# EAGLE design Shift_Rotate (EAGLE 7.6.0)
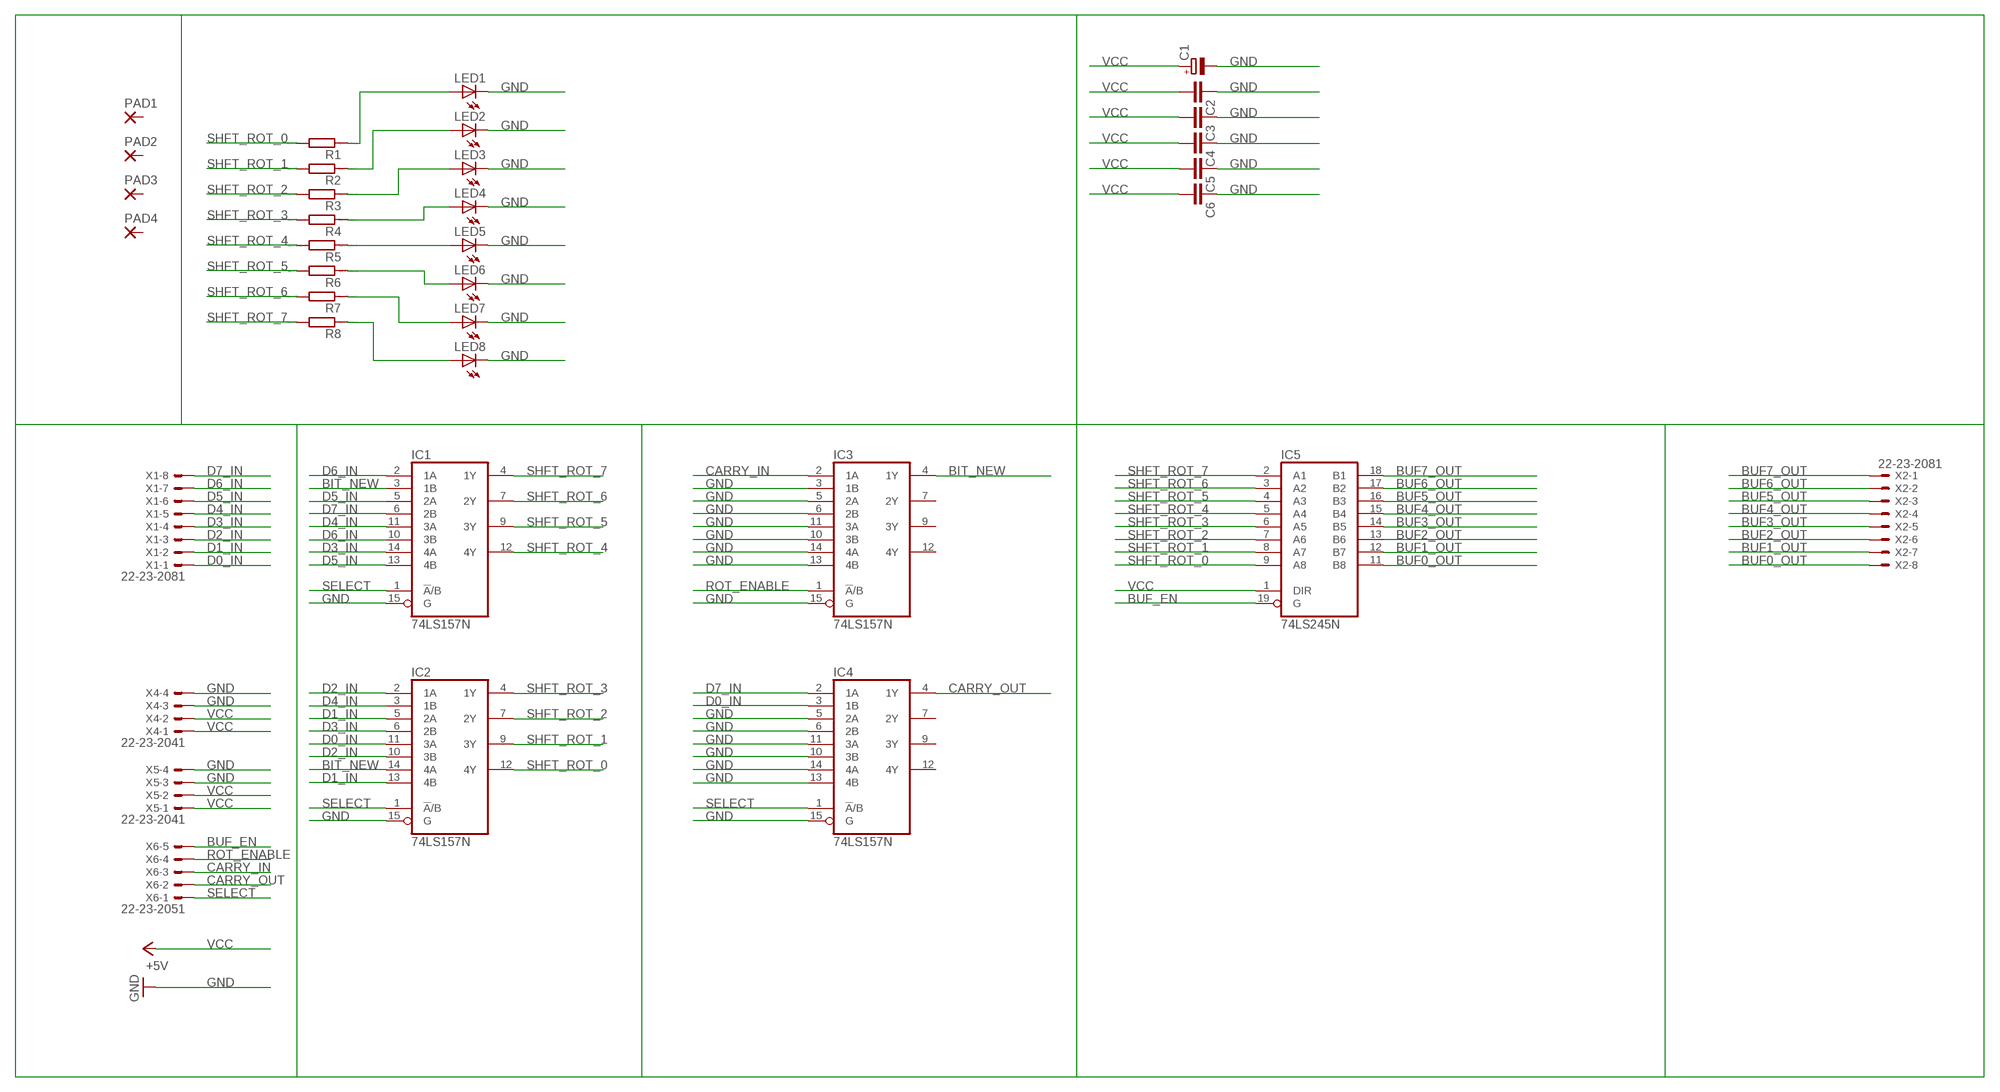
[diagram p0: schematic, sheet 1]

## Parts
C1  CPOL-EUE2.5-6  [E2,5-6]
C2  C-EU025-025X050  [C025-025X050]
C3  C-EU025-025X050  [C025-025X050]
C4  C-EU025-025X050  [C025-025X050]
C5  C-EU025-025X050  [C025-025X050]
C6  C-EU025-025X050  [C025-025X050]
IC1  74LS157N  [DIL16]
IC2  74LS157N  [DIL16]
IC3  74LS157N  [DIL16]
IC4  74LS157N  [DIL16]
IC5  74LS245N  [DIL20]
LED1  LED5MM  [LED5MM]
LED2  LED5MM  [LED5MM]
LED3  LED5MM  [LED5MM]
LED4  LED5MM  [LED5MM]
LED5  LED5MM  [LED5MM]
LED6  LED5MM  [LED5MM]
LED7  LED5MM  [LED5MM]
LED8  LED5MM  [LED5MM]
PAD1  3,17/1,3  [3,17/1,3]
PAD2  3,17/1,3  [3,17/1,3]
PAD3  3,17/1,3  [3,17/1,3]
PAD4  3,17/1,3  [3,17/1,3]
R1  R0207/10  [0207/10]
R2  R0207/10  [0207/10]
R3  R0207/10  [0207/10]
R4  R0207/10  [0207/10]
R5  R0207/10  [0207/10]
R6  R0207/10  [0207/10]
R7  R0207/10  [0207/10]
R8  R0207/10  [0207/10]
X1  22-23-2081  [22-23-2081]
X2  22-23-2081  [22-23-2081]
X4  22-23-2041  [22-23-2041]
X5  22-23-2041  [22-23-2041]
X6  22-23-2051  [22-23-2051]

## Nets
BIT_NEW [suply]: IC1.3(1B) IC2.14(4A) IC3.4(1Y)
BUF0_OUT: IC5.11(B8) X2.8
BUF1_OUT: IC5.12(B7) X2.7
BUF2_OUT: IC5.13(B6) X2.6
BUF3_OUT: IC5.14(B5) X2.5
BUF4_OUT: IC5.15(B4) X2.4
BUF5_OUT: IC5.16(B3) X2.3
BUF6_OUT: IC5.17(B2) X2.2
BUF7_OUT: IC5.18(B1) X2.1
BUF_EN: IC5.19(G) X6.5
CARRY_IN: IC3.2(1A) X6.3
CARRY_OUT: IC4.4(1Y) X6.2
D0_IN: IC2.11(3A) IC4.3(1B) X1.1
D1_IN: IC2.5(2A) IC2.13(4B) X1.2
D2_IN: IC2.2(1A) IC2.10(3B) X1.3
D3_IN: IC1.14(4A) IC2.6(2B) X1.4
D4_IN: IC1.11(3A) IC2.3(1B) X1.5
D5_IN: IC1.5(2A) IC1.13(4B) X1.6
D6_IN: IC1.2(1A) IC1.10(3B) X1.7
D7_IN: IC1.6(2B) IC4.2(1A) X1.8
GND [suply]: C1.- C2.1 C3.1 C4.1 C5.1 C6.1 IC1.15(G) IC2.15(G) IC3.3(1B) IC3.5(2A) IC3.6(2B) IC3.10(3B) IC3.11(3A) IC3.13(4B) IC3.14(4A) IC3.15(G) IC4.5(2A) IC4.6(2B) IC4.10(3B) IC4.11(3A) IC4.13(4B) IC4.14(4A) IC4.15(G) LED1.K(C) LED2.K(C) LED3.K(C) LED4.K(C) LED5.K(C) LED6.K(C) LED7.K(C) LED8.K(C) X4.3 X4.4 X5.3 X5.4
N$9: LED1.A R1.1
N$10: LED2.A R2.1
N$11: LED3.A R3.1
N$12: LED4.A R4.1
N$13: LED5.A R5.1
N$14: LED6.A R6.1
N$15: LED7.A R7.1
N$16: LED8.A R8.1
ROT_ENABLE: IC3.1(!A!/B) X6.4
SELECT: IC1.1(!A!/B) IC2.1(!A!/B) IC4.1(!A!/B) X6.1
SHFT_ROT_0: IC2.12(4Y) IC5.9(A8) R1.2
SHFT_ROT_1: IC2.9(3Y) IC5.8(A7) R2.2
SHFT_ROT_2: IC2.7(2Y) IC5.7(A6) R3.2
SHFT_ROT_3: IC2.4(1Y) IC5.6(A5) R4.2
SHFT_ROT_4: IC1.12(4Y) IC5.5(A4) R5.2
SHFT_ROT_5: IC1.9(3Y) IC5.4(A3) R6.2
SHFT_ROT_6: IC1.7(2Y) IC5.3(A2) R7.2
SHFT_ROT_7: IC1.4(1Y) IC5.2(A1) R8.2
VCC [suply]: C1.+ C2.2 C3.2 C4.2 C5.2 C6.2 IC5.1(DIR) X4.1 X4.2 X5.1 X5.2 ; supply symbol labelled +5V
Unconnected: IC3.7(2Y) IC3.9(3Y) IC3.12(4Y) IC4.7(2Y) IC4.9(3Y) IC4.12(4Y) PAD1.1(P) PAD2.1(P) PAD3.1(P) PAD4.1(P)

## Power pins joined to a net without a drawn wire
GND: IC1.8(GND) IC2.8(GND) IC3.8(GND) IC4.8(GND) IC5.10(GND)
VCC: IC1.16(VCC) IC2.16(VCC) IC3.16(VCC) IC4.16(VCC) IC5.20(VCC)

## Library data of the parts
C1 = resistor:CPOL-EU: POLARIZED CAPACITOR, European symbol
C2-C6 = resistor:C-EU: CAPACITOR, European symbol
IC1-IC4 = 74xx-us:74*157: Quadruple 2-line to 1-line data SELECTOR/MULTIPLEXER
IC5 = 74xx-us:74*245: Octal BUS TRANSCEIVER, 3-state
LED1-LED8 = led:LED: LED OSRAM: - CHIPLED LG R971, LG N971, LY N971, LG Q971, LY Q971, LO R971, LY R971 LH N974, LH R974 LS Q976, LO Q976, LY Q976 LO Q996 - Hyper CHIPLED LW Q18S LB Q993, LB Q99A, LB R99A - SideLED LS A670, LO A670, LY A670, LG A670, LP A670 LB A673, LV A673, LT A673, LW A673 LH A674 LY A675 LS A676, LA A676, LO A676, LY A676, LW A676 LS A679, LY A679, LG A679 - Hyper Micro SIDELED® LS Y876, LA Y876, LO Y876, LY Y876 LT Y87S - SmartLED LW L88C, LW L88S LB L89C, LB L89S, LG L890 LS L89K, LO L89K, LY L89K LS L896, LA L896, LO L896, LY L896 - TOPLED LS T670, LO T670, LY T670, LG T670, LP T670 LSG T670, LSP T670, LSY T670, LOP T670, LYG T670 LG T671, LOG T671, LSG T671 LB T673, LV T673, LT T673, LW T673 LH T674 LS T676, LA T676, LO T676, LY T676, LB T676, LH T676, LSB T676, LW T676 LB T67C, LV T67C, LT T67C, LS T67K, LO T67K, LY T67K, LW E67C LS E67B, LA E67B, LO E67B, LY E67B, LB E67C, LV E67C, LT E67C LW T67C LS T679, LY T679, LG T679 LS T770, LO T770, LY T770, LG T770, LP T770 LB T773, LV T773, LT T773, LW T773 LH T774 LS E675, LA E675, LY E675, LS T675 LS T776, LA T776, LO T776, LY T776, LB T776 LHGB T686 LT T68C, LB T68C - Hyper Mini TOPLED® LB M676 - Mini TOPLED Santana® LG M470 LS M47K, LO M47K, LY M47K Source: http://www.osram.convergy.de LUXEON: - LUMILED® LXK2-PW12-R00, LXK2-PW12-S00, LXK2-PW14-U00, LXK2-PW14-V00 LXK2-PM12-R00, LXK2-PM12-S00, LXK2-PM14-U00 LXK2-PE12-Q00, LXK2-PE12-R00, LXK2-PE12-S00, LXK2-PE14-T00, LXK2-PE14-U00 LXK2-PB12-K00, LXK2-PB12-L00, LXK2-PB12-M00, LXK2-PB14-N00, LXK2-PB14-P00, LXK2-PB14-Q00 LXK2-PR12-L00, LXK2-PR12-M00, LXK2-PR14-Q00, LXK2-PR14-R00 LXK2-PD12-Q00, LXK2-PD12-R00, LXK2-PD12-S00 LXK2-PH12-R00, LXK2-PH12-S00 LXK2-PL12-P00, LXK2-PL12-Q00, LXK2-PL12-R00 Source: www.luxeon.com KINGBRIGHT: KA-3528ASYC Source: www.kingbright.com
PAD1-PAD4 = wirepad:3,17/1,3: THROUGH-HOLE PAD
R1-R8 = eagle-ltspice:R: RESISTOR, European symbol; SPICEMODEL: NONE; SPICEPREFIX: R
X1 X2 = con-molex:22-23-2081: .100" (2.54mm) Center Header - 8 Pin; MF: MOLEX; MPN: 22-23-2081; OC_FARNELL: 1756826; OC_NEWARK: 01C7592
X4 X5 = con-molex:22-23-2041: .100" (2.54mm) Center Header - 4 Pin; MF: MOLEX; MPN: 22-23-2041; OC_FARNELL: 1462920; OC_NEWARK: 38C0355
X6 = con-molex:22-23-2051: .100" (2.54mm) Center Header - 5 Pin; MF: MOLEX; MPN: 22-23-2051; OC_FARNELL: 1462952; OC_NEWARK: 38C9178

## Net classes
1 suply: width 1.016 mm

## Board
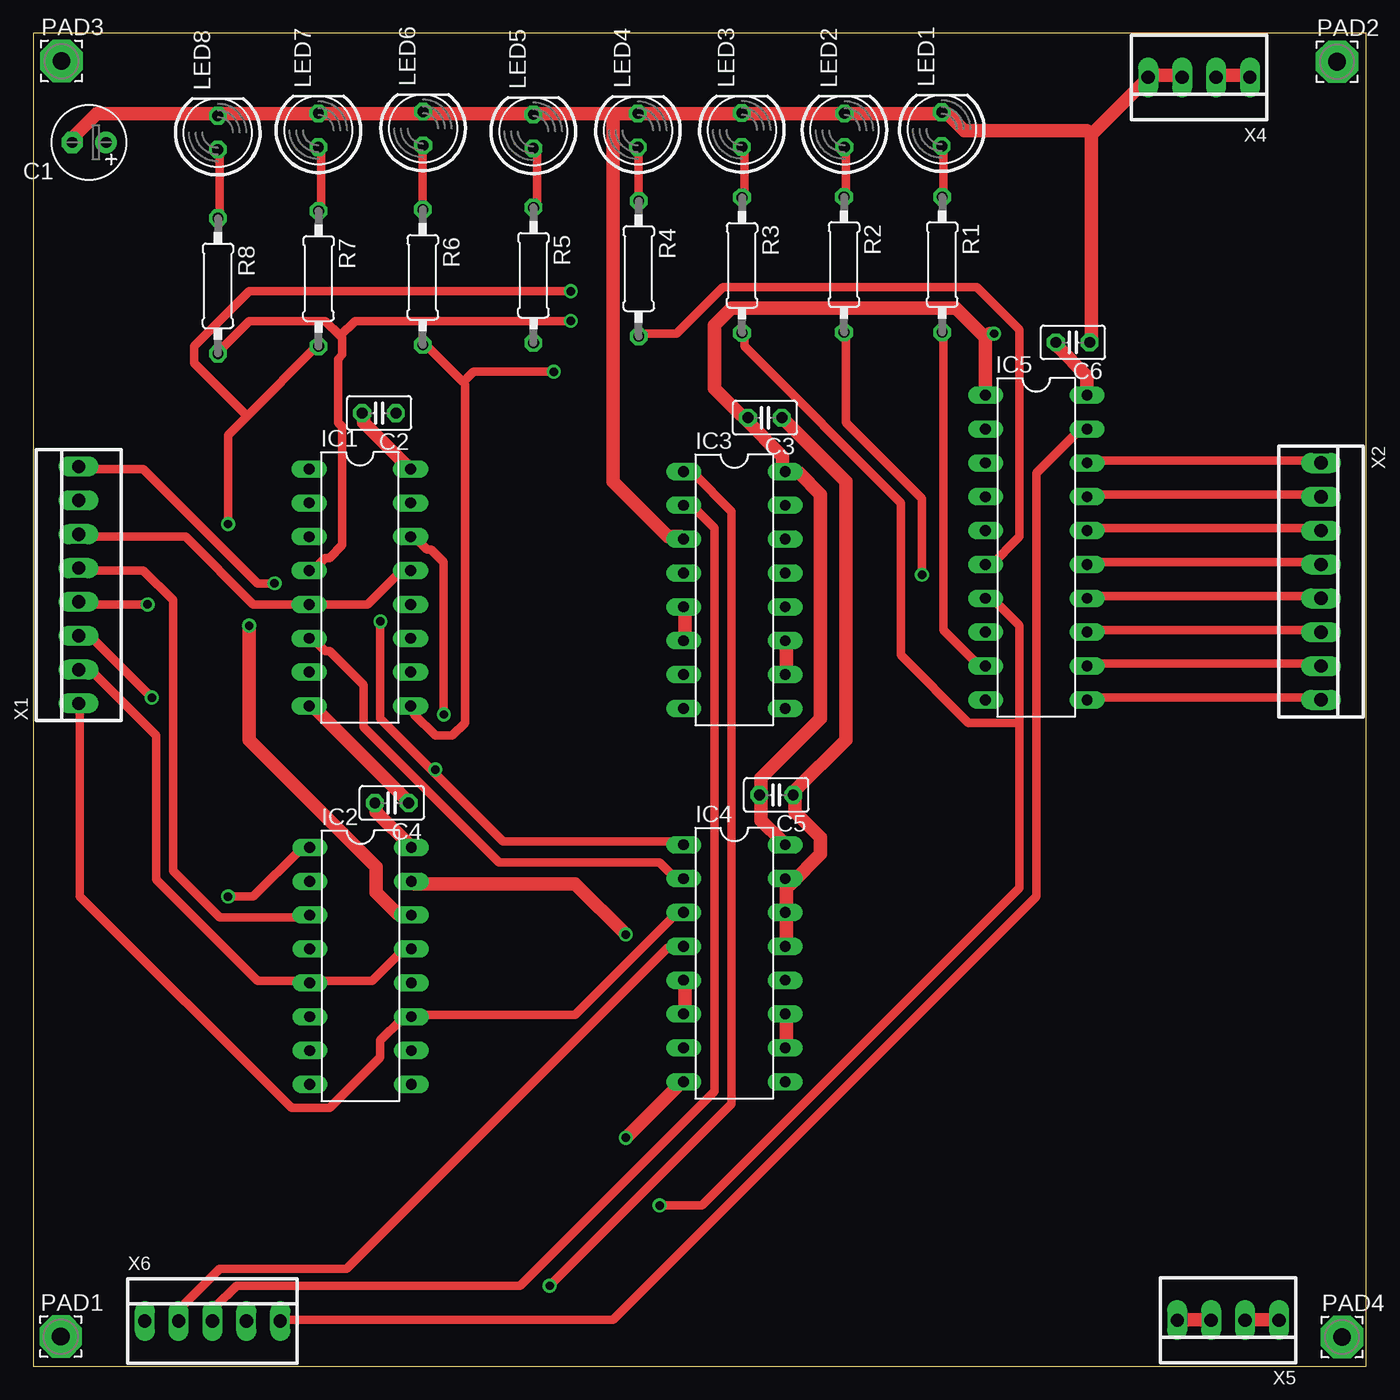
[diagram p1: board, top side]
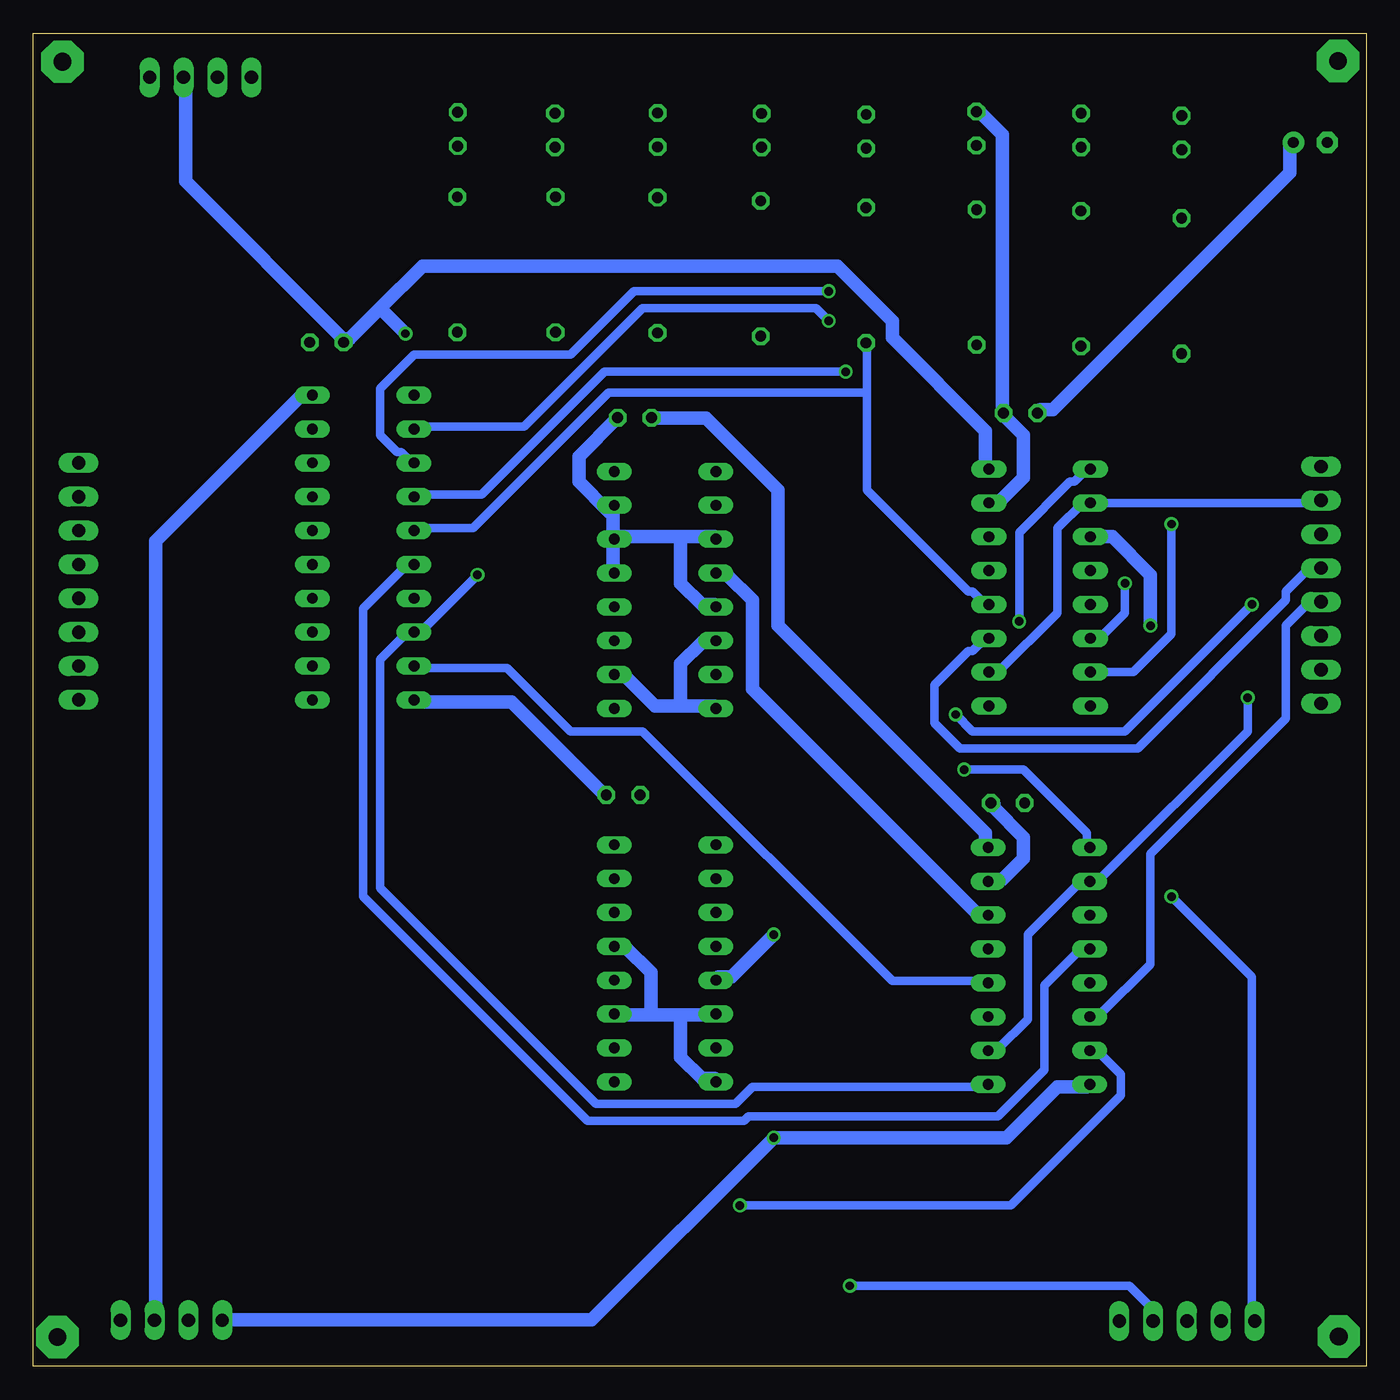
[diagram p2: board, bottom side, seen from below]

Size 100 x 100 mm. Coordinates in mm from the lower left corner, seen from the top.
Outline: 0,0 100,0 100,100 0,100 0,0
Copper layers (1*16): Top 0.035mm / dielectric 1.5mm / Bottom 0.035mm
Design rules "default *": minimum track width 25mil, minimum drill 25mil, track to track 25mil, track to pad 25mil, pad to pad 25mil, via to via 25mil, smd to smd 8mil, copper to edge 40mil, drill to drill 8mil, minimum pad ring 10mil, minimum via ring 8mil, stop-mask expansion 4mil, vias tented up to drill 0mil, thermal gap 10mil

### Footprints (pad centres in the part's own frame; a part is rotated, then mirrored left to right if it is on the bottom)
E2,5-6 = drill 0.813 pad 1.6: + -1.27,0 | drill 0.813 pad 1.6 octagon: - 1.27,0
C025-025X050 = drill 0.813 octagon: 1 -1.27,0; 2 1.27,0
DIL16 = drill 0.813 long: 1 -8.89,-3.81; 2 -6.35,-3.81; 3 -3.81,-3.81; 4 -1.27,-3.81; 5 1.27,-3.81; 6 3.81,-3.81; 7 6.35,-3.81; 8 8.89,-3.81; 9 8.89,3.81; 10 6.35,3.81; 11 3.81,3.81; 12 1.27,3.81; 13 -1.27,3.81; 14 -3.81,3.81; 15 -6.35,3.81; 16 -8.89,3.81
DIL20 = drill 0.813 long: 1 -11.43,-3.81; 2 -8.89,-3.81; 3 -6.35,-3.81; 4 -3.81,-3.81; 5 -1.27,-3.81; 6 1.27,-3.81; 7 3.81,-3.81; 8 6.35,-3.81; 9 8.89,-3.81; 10 11.43,-3.81; 11 11.43,3.81; 12 8.89,3.81; 13 6.35,3.81; 14 3.81,3.81; 15 1.27,3.81; 16 -1.27,3.81; 17 -3.81,3.81; 18 -6.35,3.81; 19 -8.89,3.81; 20 -11.43,3.81
LED5MM = drill 0.813 octagon: A -1.27,0; K 1.27,0
3,17/1,3 = drill 1.321 pad 3.175 octagon: 1 0,0
0207/10 = drill 0.813 octagon: 1 -5.08,0; 2 5.08,0
22-23-2081 = drill 1 long: 1 -8.89,0; 2 -6.35,0; 3 -3.81,0; 4 -1.27,0; 5 1.27,0; 6 3.81,0; 7 6.35,0; 8 8.89,0
22-23-2041 = drill 1 long: 1 -3.81,0; 2 -1.27,0; 3 1.27,0; 4 3.81,0
22-23-2051 = drill 1 long: 1 -5.08,0; 2 -2.54,0; 3 0,0; 4 2.54,0; 5 5.08,0

### Placement (x,y rotation side)
C1  4.19,91.81 180 top
C2  25.94,71.51 180 top
C3  54.89,71.16 180 top
C4  26.89,42.26 180 top
C5  55.74,42.86 180 top
C6  77.99,76.81 180 top
IC1  24.5,58.42 270 top
IC2  24.55,30.03 270 top
IC3  52.6,58.24 270 top
IC4  52.6,30.23 270 top
IC5  75.25,61.42 270 top
LED1  68.16,92.81 90 top
LED2  60.86,92.73 90 top
LED3  53.16,92.75 90 top
LED4  45.36,92.72 90 top
LED5  37.51,92.64 90 top
LED6  29.24,92.86 90 top
LED7  21.39,92.73 90 top
LED8  13.84,92.55 90 top
PAD1  2.06,2.22 0 top
PAD2  97.81,97.87 0 top
PAD3  2.11,97.92 0 top
PAD4  98.19,2.19 0 top
R1  68.19,82.65 270 top
R2  60.82,82.65 270 top
R3  53.17,82.6 270 top
R4  45.42,82.35 270 top
R5  37.52,81.85 270 top
R6  29.22,81.7 270 top
R7  21.4,81.6 270 top
R8  13.85,81.05 270 top
X1  3.4,58.61 90 top
X2  96.6,58.88 270 top
X4  87.46,96.7 180 top
X5  89.64,3.45 180 top
X6  13.44,3.4 0 top

### Tracks (layer width: path | path; a pad name or v marks a point on that pad's centre or on a via)
BIT_NEW  (via drill 0.64)
  Top 1.016: v16.19,55.56 16.19,46.99 25.72,37.47 25.72,35.56 27.3,33.97 28.26,33.97 IC2.14
  Bottom 1.016: IC2.14 28.57,33.97 29.21,33.97 46.04,50.8 46.04,57.47 47.94,59.37 48.58,59.37 IC3.4 | IC1.3 19.05,62.23 16.19,59.37 v16.19,55.56
BUF0_OUT
  Top 0.635: IC5.11 79.38,50.16 96.52,50.16 X2.8
BUF1_OUT
  Top 0.635: IC5.12 79.38,52.7 96.52,52.7 X2.7
BUF2_OUT
  Top 0.635: IC5.13 79.38,55.24 96.52,55.24 X2.6
BUF3_OUT
  Top 0.635: IC5.14 79.38,57.78 96.52,57.78 X2.5
BUF4_OUT
  Top 0.635: IC5.15 79.38,60.33 96.52,60.33 X2.4
BUF5_OUT
  Top 0.635: IC5.16 79.38,62.87 96.52,62.87 X2.3
BUF6_OUT
  Top 0.635: IC5.17 79.38,65.41 96.52,65.41 X2.2
BUF7_OUT
  Top 0.635: IC5.18 79.38,67.94 96.52,67.94 X2.1
BUF_EN
  Top 0.635: IC5.19 79.06,70.17 78.42,70.17 75.25,66.99 75.25,35.24 43.5,3.49 18.73,3.49 X6.5
CARRY_IN
  Top 0.635: IC3.2 48.9,64.45 49.53,64.45 51.12,62.87 51.12,20.64 36.51,6.03 15.24,6.03 13.65,4.45 13.65,3.49 X6.3
CARRY_OUT
  Top 0.635: IC4.4 48.58,31.43 47.62,31.43 23.5,7.3 13.97,7.3 11.11,4.45 11.11,3.49 X6.2
D0_IN
  Top 0.635: IC4.3 48.58,34.29 40.64,26.35 28.57,26.35 IC2.11 28.26,26.04 27.62,26.04 26.04,24.45 26.04,23.18 22.23,19.37 19.37,19.37 3.49,35.24 3.49,49.53 X1.1
D1_IN
  Top 0.635: IC2.13 28.26,31.11 27.62,31.11 25.4,28.89 20.95,28.89 IC2.5 20.64,28.89 16.83,28.89 9.21,36.51 9.21,47.31 4.45,52.07 3.49,52.07 X1.2
D2_IN  (via drill 0.64)
  Top 0.635: v8.89,50.16 4.45,54.61 3.49,54.61 X1.3
  Bottom 0.635: IC2.10 28.26,23.81 27.62,23.81 25.4,26.04 25.4,32.38 21.59,36.2 20.95,36.2 IC2.2 20.64,36.51 20,36.51 8.89,47.62 v8.89,50.16
D3_IN  (via drill 0.64)
  Top 0.635: v30.8,48.9 30.8,60.33 29.84,61.28 29.53,61.28 28.57,62.23 IC1.14 | v8.57,57.15 3.49,57.15 X1.4
  Bottom 0.635: IC2.6 20.64,26.35 20,26.35 16.19,30.16 16.19,38.42 6.03,48.58 6.03,55.56 4.45,57.15 3.49,57.15 X1.4 | v30.8,48.9 29.53,47.62 18.1,47.62 v8.57,57.15
D4_IN
  Top 0.635: IC2.3 20.64,33.66 13.97,33.66 10.48,37.15 10.48,57.47 8.26,59.69 3.49,59.69 X1.5
  Bottom 0.635: IC1.11 28.57,54.61 29.53,53.66 29.84,53.66 32.38,51.12 32.38,48.26 30.48,46.35 17.14,46.35 6.03,57.47 6.03,58.1 4.45,59.69 3.49,59.69 X1.5
D5_IN
  Top 0.635: IC1.13 27.62,59.69 25.08,57.15 IC1.5 16.51,57.15 11.43,62.23 3.49,62.23 X1.6
D6_IN
  Bottom 0.635: IC1.10 27.62,52.07 23.18,56.52 23.18,62.87 21.27,64.77 IC1.2 3.49,64.77 X1.7
D7_IN  (via drill 0.64)
  Top 0.635: IC1.6 20.95,54.61 21.91,53.66 22.23,53.66 24.77,51.12 24.77,47.94 34.92,37.78 46.99,37.78 47.94,36.83 48.58,36.83 IC4.2 | v18.1,58.74 16.83,58.74 8.26,67.31 3.49,67.31 X1.8
  Bottom 0.635: v18.1,58.74 18.1,56.52 20,54.61 IC1.6
GND  (via drill 0.64)
  Top 1.016: C1.- 3.17,92.08 3.17,92.39 4.76,93.98 13.34,93.98 LED8.K 13.97,93.98 21.27,93.98 LED7.K 21.91,93.98 29.21,93.98 LED6.K 29.53,93.98 37.15,93.98 LED5.K 37.78,93.98 43.5,93.98 | 79.38,92.39 79.38,76.83 C6.1 | 79.38,92.39 83.5,96.52 X4.4 84.14,96.84 86.04,96.84 X4.3 | 43.5,93.98 45.09,93.98 LED4.K 45.72,93.98 52.7,93.98 LED3.K 53.34,93.98 60.64,93.98 LED2.K 60.96,93.98 67.94,93.98 LED1.K 68.58,93.98 69.85,92.71 79.06,92.71 79.38,92.39 | IC3.6 48.9,54.61 48.9,56.83 IC3.5 | IC3.11 56.52,54.29 56.52,52.07 IC3.10 | IC4.13 56.52,31.75 56.52,33.97 IC4.14 56.52,34.29 56.52,36.51 IC4.15 56.83,36.2 59.05,38.42 59.05,39.69 57.15,41.59 57.15,42.55 C5.1 57.15,43.18 60.96,46.99 60.96,66.36 56.2,71.12 C3.1 | IC1.8 20.95,49.53 27.94,42.55 C4.1 | IC4.10 56.52,24.13 56.52,26.35 IC4.11 | IC4.6 48.9,26.67 48.9,28.89 IC4.5 | X5.4 86.04,3.49 88.27,3.49 X5.3 | v44.45,17.14 48.58,21.27 IC4.8 | v44.45,32.38 40.64,36.2 28.57,36.2 IC2.15 | 43.5,93.98 43.5,66.36 47.62,62.23 48.58,62.23 IC3.3
  Bottom 1.016: IC1.15 27.62,64.77 25.72,66.67 25.72,69.85 27.3,71.44 C2.1 27.3,71.75 27.3,92.39 29.21,94.3 LED6.K | 51.44,49.53 53.34,49.53 55.56,51.75 56.2,51.75 IC3.10 | 51.44,49.53 48.9,49.53 IC3.8 | 51.44,49.53 51.44,52.7 49.85,54.29 48.9,54.29 IC3.6 | 51.44,62.23 56.2,62.23 IC3.14 | 51.44,62.23 48.9,62.23 IC3.3 | IC3.13 56.52,59.69 56.52,61.59 IC3.14 | IC3.14 56.52,62.55 56.52,64.45 IC3.15 56.83,64.14 59.05,66.36 59.05,68.26 56.2,71.12 C3.1 | 51.44,62.23 51.44,58.74 49.85,57.15 48.9,57.15 IC3.5 | IC5.10 71.44,49.85 64.14,49.85 57.15,42.86 C5.1 | C4.1 27.94,42.23 27.94,41.91 25.72,39.69 25.72,38.1 27.3,36.51 28.26,36.51 IC2.15 | 51.44,26.35 48.9,26.35 IC4.6 | 51.44,26.35 53.66,26.35 | 53.66,26.35 56.2,26.35 IC4.11 | IC2.8 20.95,20.95 23.18,20.95 26.99,17.14 v44.45,17.14 58.1,3.49 85.72,3.49 X5.4 | 51.44,26.35 51.44,23.18 49.85,21.59 48.9,21.59 IC4.8 | v44.45,32.38 47.62,29.21 48.58,29.21 IC4.5 | 53.66,26.35 53.66,29.53 55.56,31.43 56.2,31.43 IC4.13
N$9
  Top 0.635: LED1.A 68.26,91.44 68.26,87.95 R1.1
N$10
  Top 0.635: R2.1 60.96,87.95 60.96,91.44 LED2.A
N$11
  Top 0.635: LED3.A 53.34,91.44 53.34,87.95 R3.1
N$12
  Top 0.635: LED4.A 45.4,91.44 45.4,87.63 R4.1
N$13
  Top 0.635: LED5.A 37.78,91.12 37.78,87 R5.1
N$14
  Top 0.635: R6.1 29.21,87 29.21,91.44 LED6.A
N$15
  Top 0.635: LED7.A 21.59,91.44 21.59,87 R7.1
N$16
  Top 0.635: LED8.A 13.97,91.12 13.97,86.36 R8.1
ROT_ENABLE  (via drill 0.64)
  Top 0.635: v38.73,6.03 52.39,19.68 52.39,64.14 49.53,66.99 48.9,66.99 IC3.1
  Bottom 0.635: v38.73,6.03 17.78,6.03 16.19,4.45 16.19,3.49 X6.4
SELECT  (via drill 0.64)
  Top 0.635: v26.04,55.88 26.04,48.58 30,44.61 | 30,44.61 35.24,39.37 48.58,39.37 IC4.1 | v30.16,44.77 30,44.61 | v14.61,35.24 16.51,35.24 20,38.73 20.64,38.73 IC2.1
  Bottom 0.635: v26.04,55.88 26.04,62.55 22.23,66.36 21.91,66.36 20.95,67.31 IC1.1 | v30.16,44.77 25.72,44.77 20.95,40.01 20.95,39.05 IC2.1 | v14.61,35.24 8.57,29.21 8.57,3.49 X6.1
SHFT_ROT_0
  Top 0.635: R1.2 68.26,77.47 68.26,55.24 70.8,52.7 71.44,52.7 IC5.9
  Bottom 0.635: IC2.12 28.57,28.89 35.56,28.89 54.29,47.62 59.69,47.62 64.45,52.39 71.44,52.39 IC5.9
SHFT_ROT_1  (via drill 0.64)
  Top 0.635: v66.67,59.37 66.67,65.09 60.96,70.8 60.96,77.47 R2.2
  Bottom 0.635: IC2.9 28.57,20.95 46.04,20.95 47.31,19.68 57.78,19.68 73.98,35.88 73.98,53.02 71.75,55.24 IC5.8 71.44,55.24 70.8,55.24 v66.67,59.37
SHFT_ROT_2  (via drill 0.64)
  Top 0.635: v46.99,12.06 50.16,12.06 73.98,35.88 73.98,48.26 | 73.98,48.26 73.98,55.56 71.75,57.78 IC5.7 | 73.98,48.26 70.17,48.26 65.09,53.34 65.09,64.77 53.34,76.52 53.34,77.47 R3.2
  Bottom 0.635: v46.99,12.06 26.67,12.06 18.41,20.32 18.41,21.91 20,23.5 20.64,23.5 IC2.7
SHFT_ROT_3
  Top 0.635: R4.2 45.72,77.47 48.26,77.47 51.75,80.96 70.8,80.96 73.98,77.79 73.98,62.23 71.75,60.01 IC5.6
  Bottom 0.635: IC2.4 20.95,31.11 21.59,31.11 24.13,28.57 24.13,22.23 27.62,18.73 46.35,18.73 46.67,18.41 58.42,18.41 75.25,35.24 75.25,56.83 71.75,60.33 IC5.6
SHFT_ROT_4
  Bottom 0.635: 37.47,73.03 37.47,76.52 R5.2 | 37.47,73.03 37.47,65.72 29.84,58.1 29.53,58.1 28.57,57.15 IC1.12 | 37.47,73.03 56.83,73.03 66.99,62.87 71.44,62.87 IC5.5
SHFT_ROT_5  (via drill 0.64)
  Top 0.635: 32.23,73.82 29.53,76.52 R6.2 | 32.23,73.82 32.38,73.66 32.38,48.26 31.43,47.31 30.16,47.31 28.57,48.9 28.57,49.53 IC1.9 | v39.05,74.61 33.02,74.61 32.23,73.82
  Bottom 0.635: v39.05,74.61 57.15,74.61 66.36,65.41 71.44,65.41 IC5.4
SHFT_ROT_6  (via drill 0.64)
  Top 0.635: v14.61,63.18 14.61,69.85 16.03,71.28 | 16.03,71.28 21.27,76.52 R7.2 | v40.32,80.64 16.19,80.64 12.06,76.52 12.06,75.25 16.03,71.28
  Bottom 0.635: IC1.7 17.46,52.07 14.61,54.93 v14.61,63.18 | v40.32,80.64 54.93,80.64 59.69,75.88 71.44,75.88 73.98,73.34 73.98,69.85 72.71,68.58 72.39,68.58 71.75,67.94 IC5.3
SHFT_ROT_7  (via drill 0.64)
  Top 0.635: 23.02,77.31 21.91,78.42 16.19,78.42 13.97,76.2 R8.2 | 23.02,77.31 23.18,77.15 23.18,75.88 22.86,75.56 22.86,70.8 23.18,70.48 23.18,61.59 22.23,60.64 21.91,60.64 20.95,59.69 IC1.4 | v40.32,78.42 24.13,78.42 23.02,77.31
  Bottom 0.635: v40.32,78.42 41.27,79.38 54.29,79.38 63.18,70.48 71.44,70.48 IC5.2
VCC  (via drill 0.64)
  Top 1.016: IC2.16 28.26,39.05 25.72,41.59 25.72,42.23 C4.2 | IC4.16 56.2,39.37 54.61,40.96 54.61,42.55 C5.2 54.61,43.18 54.61,44.13 59.05,48.58 59.05,65.41 57.47,66.99 56.83,66.99 IC3.16 56.2,67.31 56.2,68.26 53.34,71.12 C3.2 53.02,71.44 51.12,73.34 51.12,78.11 52.39,79.38 69.22,79.38 71.44,77.15 | 71.44,77.15 71.44,73.03 IC5.1 | C2.2 24.77,71.44 24.77,70.8 28.26,67.31 IC1.16 | X4.2 88.9,96.84 91.12,96.84 X4.1 | X5.2 91.12,3.49 93.34,3.49 X5.1 | IC5.20 79.06,73.03 79.06,74.3 76.83,76.52 C6.2 | v72.07,77.47 71.75,77.47 71.44,77.15
  Bottom 1.016: IC2.16 28.57,39.05 28.57,40.01 44.13,55.56 44.13,65.72 49.53,71.12 53.34,71.12 C3.2 | C1.+ 5.71,91.76 5.71,89.53 23.5,71.75 24.45,71.75 C2.2 | X5.2 90.81,3.49 90.81,61.91 80.01,72.71 79.38,72.71 IC5.20 | X4.2 88.58,96.52 88.58,88.9 76.52,76.83 C6.2 76.2,77.15 73.98,79.38 | 73.98,79.38 70.8,82.55 39.69,82.55 35.56,78.42 35.56,77.15 28.57,70.17 28.57,67.31 IC1.16 | 73.98,79.38 v72.07,77.47